# EasyEDA Pro project ProDocument_USB_POWER_2023-10-14.epro

# Schematic Schematic1
Create Date: 2023-09-19; Page Name: USB_POWER; Project Name: DEC_01; Schematic Name: Schematic1; Update Date: 2023-09-24; Company: 嘉立创EDA; Page Size: A4; Version: V1.0
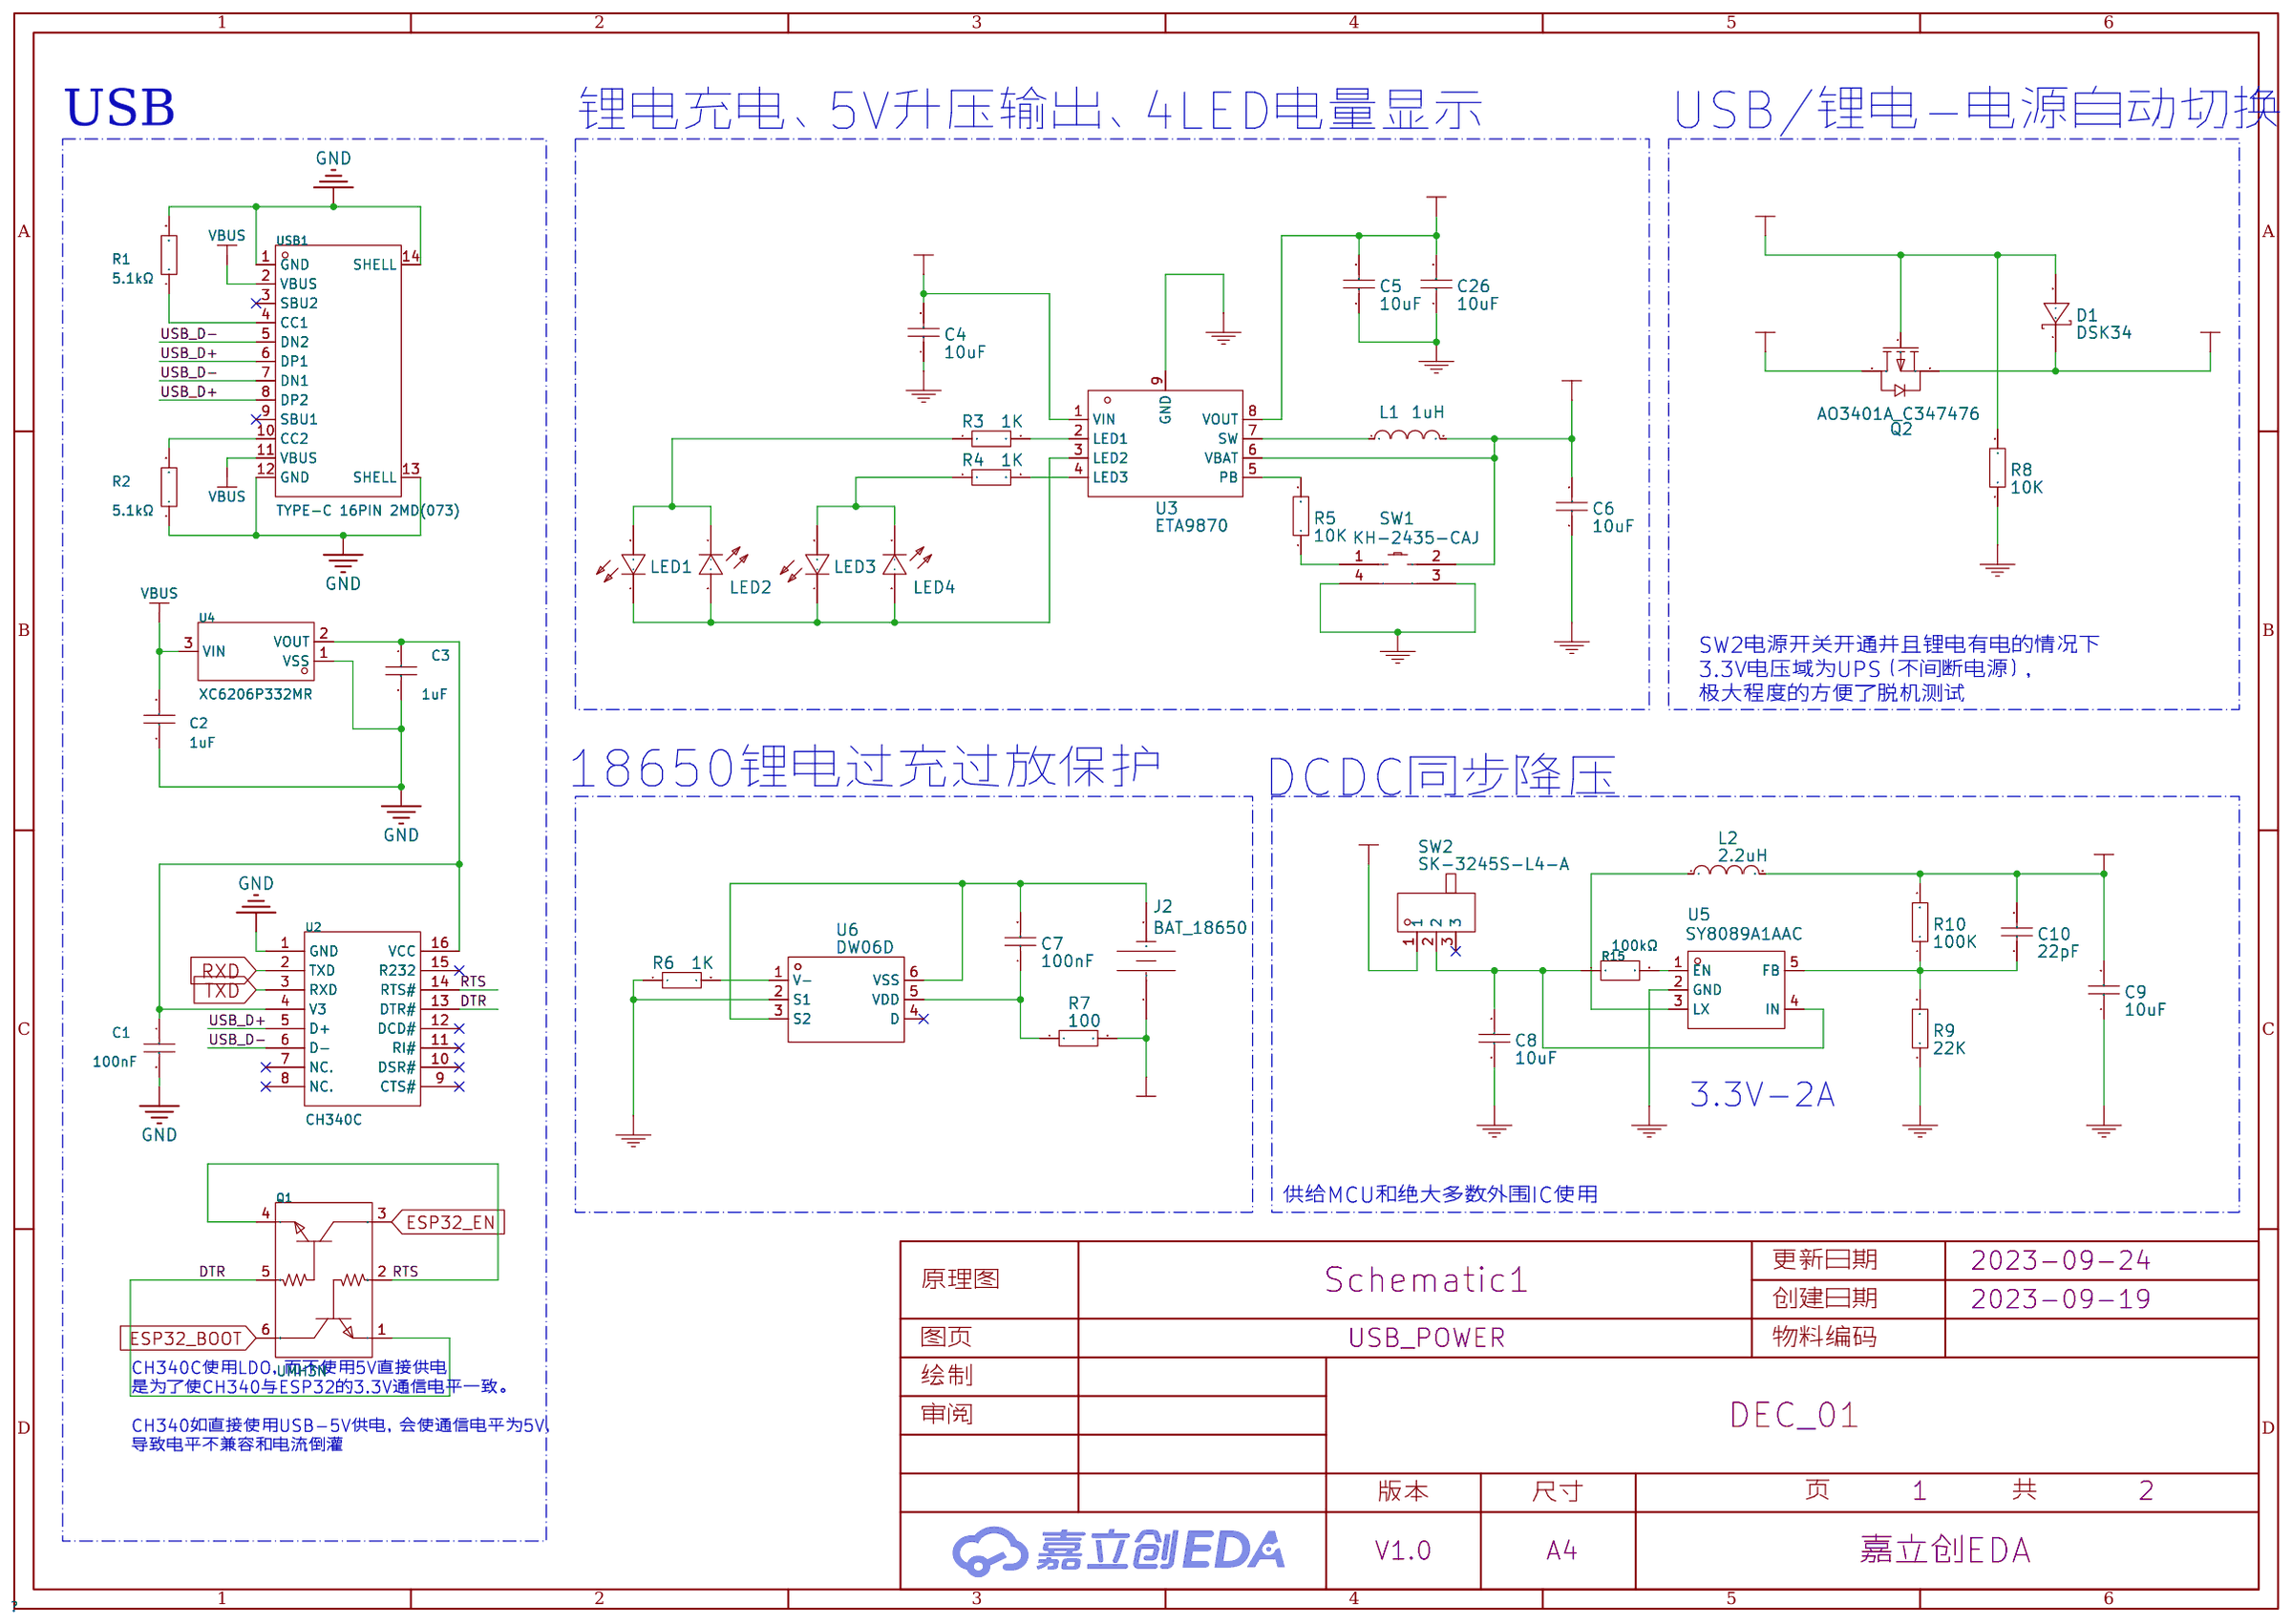
[diagram p0: schematic sheet]

## Parts
C1  100nF  [C0603]
C2  1uF  [C0603]
C3  1uF  [C0603]
C4  10uF
C5  10uF
C6  10uF
C7  100nF
C8  10uF
C9  10uF
C10  22pF
C26  10uF
D1  DSK34
J2  BAT_18650
L1  1uH
L2  2.2uH
LED1  FC-DA1608BK-470H10
LED2  FC-DA1608BK-470H10
LED3  FC-DA1608BK-470H10
LED4  FC-DA1608BK-470H10
Q1  UMH3N  [SC-70-6_L2.2-W1.3-P0.65-LS2.1-BR]
Q2  AO3401A_C347476
R1  5.1kΩ  [R0603]
R2  5.1kΩ  [R0603]
R3  1K
R4  1K
R5  10K
R6  1K
R7  100
R8  10K
R9  22K
R10  100K
R15  100kΩ  [RES-SMD_L1.6-W0.8-P1.4]
SW1  KH-2435-CAJ
SW2  SK-3245S-L4-A
U2  CH340C  [SOP-16_L10.0-W3.9-P1.27-LS6.0-BL]
U3  ETA9870
U4  XC6206P332MR  [SOT-23-3_L3.0-W1.7-P0.95-LS2.9-BR]
U5  SY8089A1AAC
U6  DW06D
USB1  TYPE-C 16PIN 2MD(073)  [USB-C-SMD_TYPE-C-6PIN-2MD-073]

## Library data of the parts
C1 = 0603B104K500NT: 容值:100nF;精度:±10%;额定电压:50V;材质(温度系数):X7R;; LCSC Part Name: 100nF ±10% 50V; Supplier Part: C30926; Manufacturer: FH(风华); Supplier Footprint: 0603; JLCPCB Part Class: 扩展库; Datasheet: https://atta.szlcsc.com/upload/public/pdf/source/20170923/C30926_1506149436298988724.pdf; Supplier: LCSC; Tolerance: ±10%; Voltage Rated: 50V; Temperature Coefficient: X7R
C2 C3 = CL10A105KB8NNNC: 容值:1uF;精度:±10%;额定电压:50V;材质(温度系数):X5R;; LCSC Part Name: 1uF ±10% 50V; Supplier Part: C15849; Manufacturer: SAMSUNG(三星); Supplier Footprint: 0603; JLCPCB Part Class: Basic Part; Datasheet: https://atta.szlcsc.com/upload/public/pdf/source/20160103/1457707679084.pdf; Supplier: LCSC; Tolerance: ±10%; Voltage Rated: 50V; Temperature Coefficient: X5R
C4-C6 C8 C9 C26 = CL05A106MQ5NUNC: Supplier: LCSC; Manufacturer: SAMSUNG; Supplier Part: C15525; JLCPCB Part Class: Basic Part
C7 = CL05B104KO5NNNC: Supplier: LCSC; Manufacturer: SAMSUNG; Supplier Part: C1525; JLCPCB Part Class: Basic Part
C10 = 0402CG220J500NT: Supplier: LCSC; Manufacturer: FH; Supplier Part: C1555; JLCPCB Part Class: Basic Part
D1 = DSK34: Supplier: LCSC; Manufacturer: MDD; Supplier Part: C41029; JLCPCB Part Class: Extended Part
J2 = BAT_18650: link: https://item.taobao.com/item.htm?spm=a230r.1.14.16.2e6d2906QYwnHuamp;id=554579677172amp;ns=1amp;abbucket=18#detail
L1 = WPN4020H1R0MT: Supplier: LCSC; Manufacturer: Sunlord; Supplier Part: C98359; JLCPCB Part Class: Extended Part
L2 = WPN4020H2R2MT: Supplier: LCSC; Manufacturer: Sunlord; Supplier Part: C98361; JLCPCB Part Class: Extended Part
LED1-LED4 = FC-DA1608BK-470H10: Supplier: LCSC; Manufacturer: NATIONSTAR; Supplier Part: C84266; JLCPCB Part Class: Extended Part
Q1 = UMH3N: 晶体管类型:2个NPN-预偏置;功率(Pd):150mW;集电极电流(Ic):100mA;集射极击穿电压(Vceo):50V;; LCSC Part Name: 电流:100mA 耐压:50V; Supplier Part: C62892; Manufacturer: CJ(江苏长电/长晶); Supplier Footprint: SOT-363-6(SC-70-6); JLCPCB Part Class: 扩展库; Datasheet: https://atta.szlcsc.com/upload/public/pdf/source/20151109/1457707575095.pdf; Supplier: LCSC; Transistor Type: 2个NPN-预偏置; Power Dissipation (Pd): 150mW; Collector Current (Ic): 100mA; Collector-Emitter Breakdown Voltage (Vceo): 50V
Q2 = AO3401A: Supplier: LCSC; Supplier Part: C347476; Manufacturer: Youtai Semiconductor Co., Ltd.; JLCPCB Part Class: Extended Part
R1 R2 = 0603WAF5101T5E: 电阻类型:厚膜电阻;阻值:5.1kΩ;精度:±1%;功率:100mW;; LCSC Part Name: 5.1kΩ ±1% 100mW; Supplier Part: C23186; Manufacturer: UNI-ROYAL(厚声); Supplier Footprint: 0603; JLCPCB Part Class: Basic Part; Datasheet: https://atta.szlcsc.com/upload/public/pdf/source/20200306/C422600_1E6D84923E4A46A82E41ADD87F860B5C.pdf; Supplier: LCSC; Type: 厚膜电阻; Tolerance: ±1%; Power(Watts): 100mW; Temperature Coefficient: ±100ppm/℃; Overload Voltage (Max): 75V; Operating Temperature Range: -55℃~+155℃
R3 R4 R6 = 0402WGF1001TCE: Supplier: LCSC; Manufacturer: UniOhm; Supplier Part: C11702; JLCPCB Part Class: Basic Part
R5 R8 = 0402WGF1002TCE: Supplier: LCSC; Manufacturer: UniOhm; Supplier Part: C25744; JLCPCB Part Class: Basic Part
R7 = 0402WGF1000TCE: Supplier: LCSC; Manufacturer: UniOhm; Supplier Part: C25076; JLCPCB Part Class: Basic Part
R9 = 0402WGF2202TCE: Supplier: LCSC; Manufacturer: UniOhm; Supplier Part: C25768; JLCPCB Part Class: Basic Part
R10 = 0402WGF1003TCE: Supplier: LCSC; Manufacturer: UniOhm; Supplier Part: C25741; JLCPCB Part Class: Basic Part
R15 = HoLTT0603-1/10W-100KR-1%: 阻值:100kΩ;功率:100mW;; LCSC Part Name: 100kΩ 100mW; Supplier Part: C2904537; Manufacturer: Milliohm(毫欧); Supplier Footprint: 0603; JLCPCB Part Class: 扩展库; Datasheet: https://atta.szlcsc.com/upload/public/pdf/source/20211021/528351F376078D6228C985A842C3763C.pdf; Supplier: LCSC; Power(Watts): 100mW
SW1 = 1TS003B-1600-3500A: Supplier: LCSC; Supplier Part: C255808; Manufacturer: HYP; JLCPCB Part Class: Extended Part
SW2 = SK-3245S-L4-A: Supplier: LCSC; Supplier Part: C500049; Manufacturer: XKB Enterprise; JLCPCB Part Class: Extended Part
U2 = CH340C: 应用功能:收发器;接口协议:USB 2.0;数据速率:2Mbps;; LCSC Part Name: CH340C USB转串口芯片 CH340; Supplier Part: C84681; Manufacturer: WCH(南京沁恒); Supplier Footprint: SOP-16; JLCPCB Part Class: 扩展库; Datasheet: https://atta.szlcsc.com/upload/public/pdf/source/20200819/C84681_ADBED554CE321879DBD6B1D06488689C.pdf; Supplier: LCSC; Applications Function: 收发器; Protocol: USB 2.0; Data Rate: 2Mbps; Supply Voltage: 3.3V；5V
U3 = ETA9870: Manufacturer: 钰泰半导体ETA; link: http://etasolution.com/w-cn/prod_det.html?id=113
U4 = XC6206P332MR_C347376: 输出类型:固定;输出极性:正;最大输入电压:8V;输出电压:3.3V;输出电流:250mA;电源纹波抑制比(PSRR):40dB@(1kHz);; LCSC Part Name: 输入8V 输出3.3V 250mA; Supplier Part: C347376; Manufacturer: UMW(友台半导体); Supplier Footprint: SOT-23(TO-236); JLCPCB Part Class: 扩展库; Datasheet: https://atta.szlcsc.com/upload/public/pdf/source/20211011/2FF0EF86CD1346BC1578534D6C1D0E45.pdf; Supplier: LCSC; Output Type: 固定; Output Polarity: 正; Number of Outputs: 1; Maximum Input Voltage: 8V; Output Voltage: 3.3V; Dropout Voltage: 240mV@(50mA); Output Current: 250mA; Power Supply Rejection Ratio (PSRR): 40dB@(1kHz); Operating Temperature: -25℃~+80℃
U5 = SY8089A1AAC: Supplier: LCSC; Supplier Part: C479074; Manufacturer: Silergy Corp; JLCPCB Part Class: Extended Part
U6 = DW06D: Supplier: LCSC; Manufacturer: FM; Supplier Part: C82123; JLCPCB Part Class: Extended Part
USB1 = TYPE-C 16PIN 2MD(073): 连接器类型:Type-C;标准:-;公母:母座;触点数量:16;端口数量:1;安装方式:卧贴;额定电流 - 电源:5A;工作温度范围:-25℃~+85℃;; LCSC Part Name: TYPE-C母座 16P 4脚插件带定位柱 不锈钢外壳 2次模顶; Supplier Part: C2765186; Manufacturer: SHOU HAN(首韩); Supplier Footprint: SMD; JLCPCB Part Class: Extended Part; Supplier: LCSC; Connector Type: Type-C; Gender: 母座; Number of Contacts: 16; Number of Ports: 1; Mounting Style: 卧贴; Current Rating - Power (Max): 5A; Operating Temperature Range: -25℃~+85℃

## Nets
+3.3V: C9.2 C10.2 L2.2 R10.2
+5V_OUT: C5.2 C26.2 U3.8(VOUT)
GND: C1.2 C2.1 C3.1 C4.1 C5.1 C6.1 C8.1 C9.1 C26.1 R1.2 R2.1 R6.1 R8.1 R9.1 SW1.3 SW1.4 U2.1(GND) U3.9(GND) U4.1(VSS) U5.2(GND) U6.2(S1) USB1.1(GND) USB1.12(GND) USB1.13(SHELL) USB1.14(SHELL)
VBAT_4.2V: C6.2 J2.1 L1.2 Q2.3(D) R7.2 SW1.2 U3.6(VBAT)
VBUS: C2.2 C4.2 D1.2(A) Q2.1(G) R8.2 U3.1(VIN) U4.3(VIN) USB1.2(VBUS) USB1.11(VBUS)
VIN: D1.1(K) Q2.2(S) SW2.1
DTR: Q1.1(E) Q1.5(B) U2.13(DTR#)
ESP32_BOOT: Q1.6(C)
ESP32_EN: Q1.3(C)
RTS: Q1.2(B) Q1.4(E) U2.14(RTS#)
RXD: U2.2(TXD)
TXD: U2.3(RXD)
USB_D+: U2.5(D+) USB1.6(DP1) USB1.8(DP2)
USB_D-: U2.6(D-) USB1.5(DN2) USB1.7(DN1)
Net-(C1-1): C1.1 C3.2 U2.4(V3) U2.16(VCC) U4.2(VOUT)
Net-(C7-1): C7.1 R7.1 U6.5(VDD)
Net-(C7-2): C7.2 J2.2 U6.3(S2) U6.6(VSS)
Net-(C8-2): C8.2 R15.1 SW2.2 U5.4(IN)
Net-(C10-1): C10.1 R9.2 R10.1 U5.5(FB)
Net-(L1-1): L1.1 U3.7(SW)
Net-(L2-1): L2.1 U5.3(LX)
Net-(LED1-1): LED1.1(-) LED2.2(+) LED3.1(-) LED4.2(+) U3.3(LED2)
Net-(LED1-2): LED1.2(+) LED2.1(-) R3.1
Net-(LED3-2): LED3.2(+) LED4.1(-) R4.1
Net-(R1-1): R1.1 USB1.4(CC1)
Net-(R2-2): R2.2 USB1.10(CC2)
Net-(R3-2): R3.2 U3.2(LED1)
Net-(R4-2): R4.2 U3.4(LED3)
Net-(R5-1): R5.1 SW1.1
Net-(R5-2): R5.2 U3.5(PB)
Net-(R6-2): R6.2 U6.1(V-)
Net-(R15-2): R15.2 U5.1(EN)

Not connected (* = marked no-connect by the designer): SW2 3*; U2 7(NC.)* 8(NC.)* 9(CTS#)* 10(DSR#)* 11(RI#)* 12(DCD#)* 15(R232)*; U6 4(D)*; USB1 3(SBU2)* 9(SBU1)*

## Notes on the sheet
- 锂电充电、5V升压输出、4LED电量显示
- USB/锂电-电源自动切换
- USB
- SW2电源开关开通并且锂电有电的情况下
  3.3V电压域为UPS（不间断电源），
  极大程度的方便了脱机测试
- 18650锂电过充过放保护
- DCDC同步降压
- 3.3V-2A
- 供给MCU和绝大多数外围IC使用
- CH340C使用LDO，而不使用5V直接供电
  是为了使CH340与ESP32的3.3V通信电平一致。
  CH340如直接使用USB-5V供电，会使通信电平为5V，
  导致电平不兼容和电流倒灌
